# EAGLE schematic Arduino Environment Monitor (EAGLE 7.5.0)
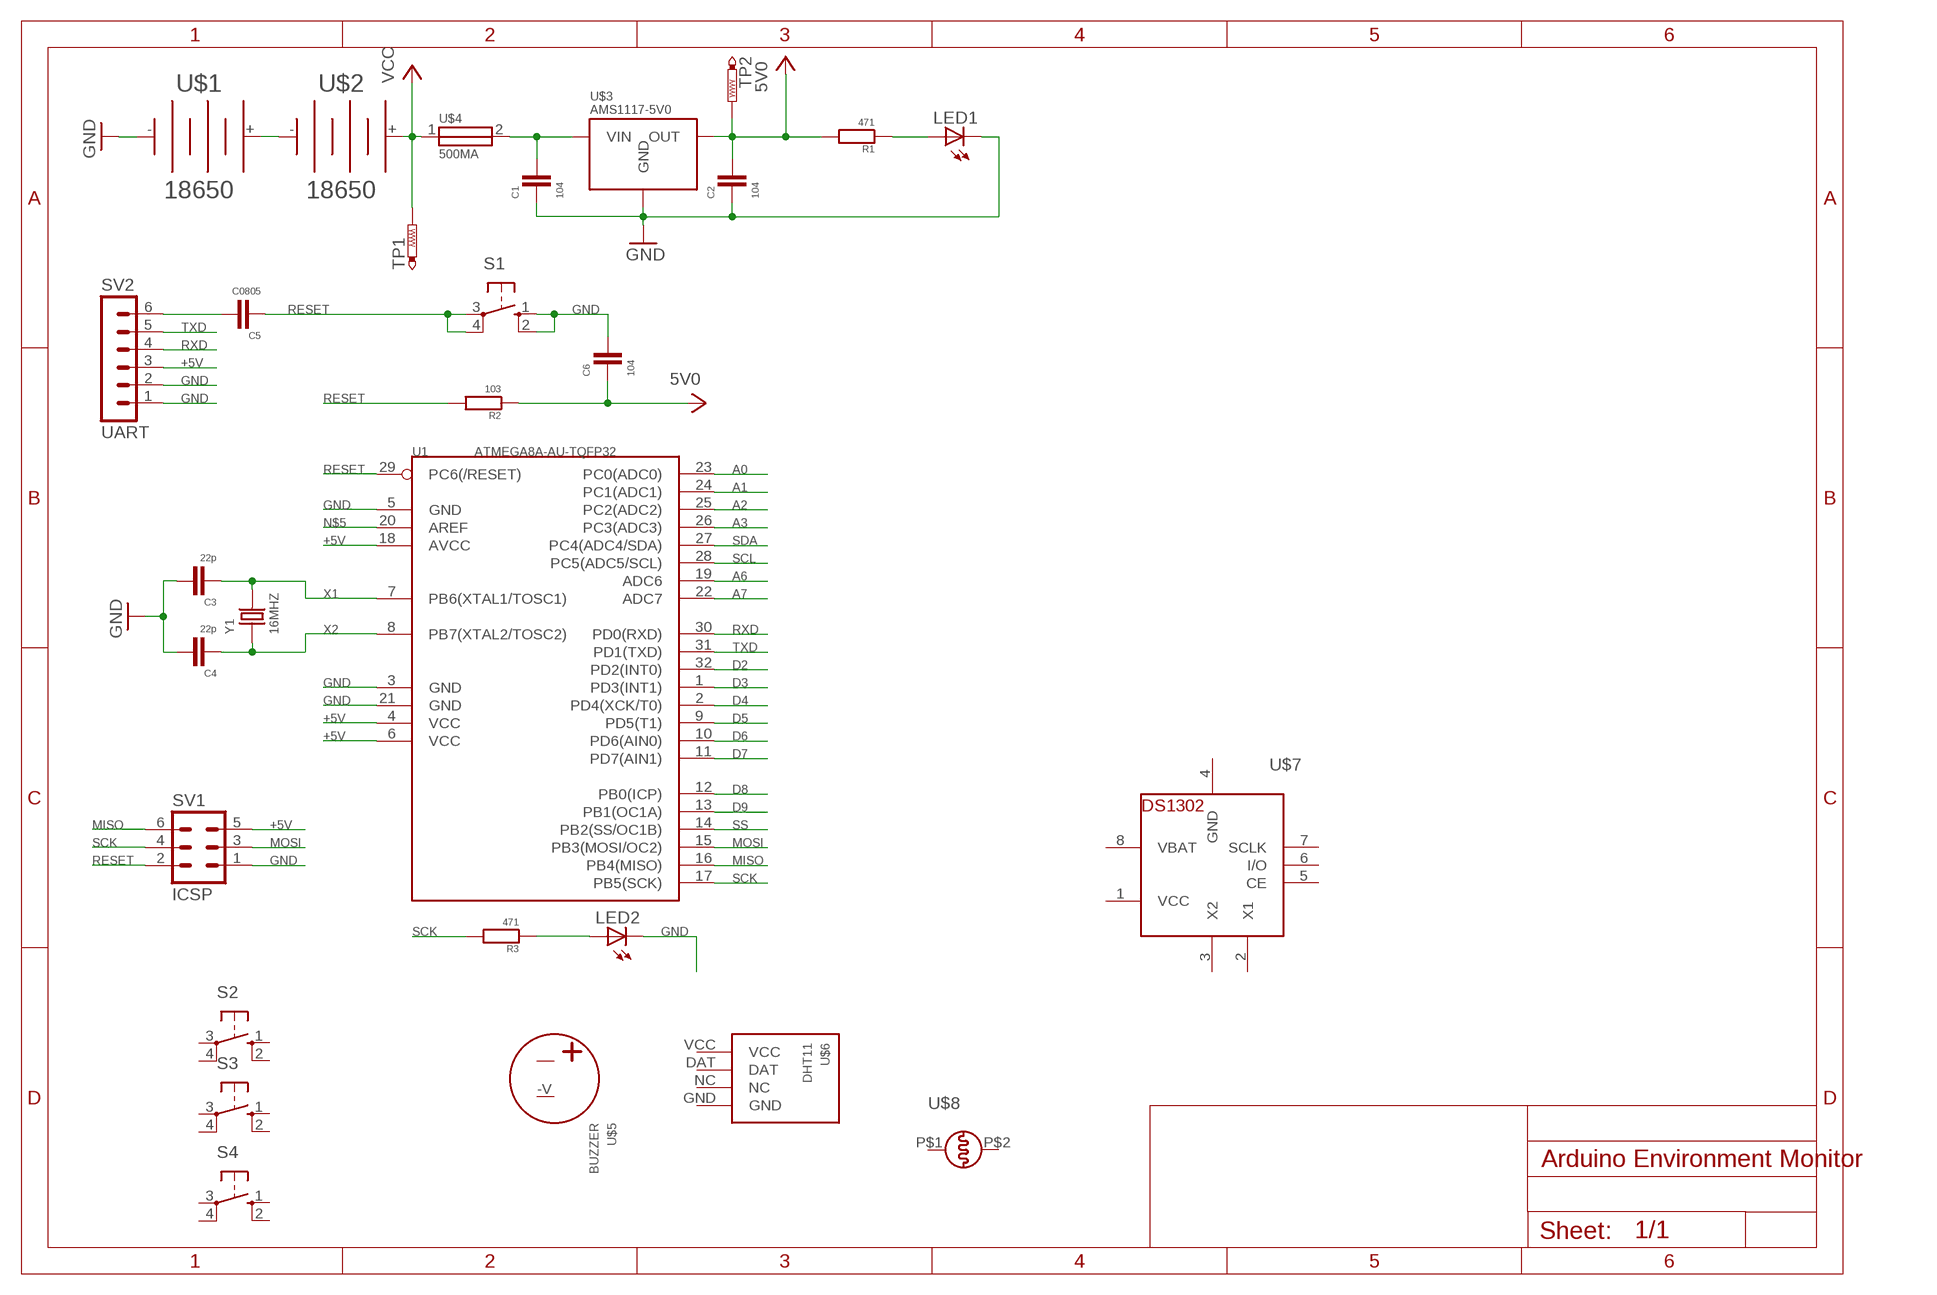
[diagram p0: schematic, sheet 1]

## Parts
C1  104  C0805  [C0805]
C2  104  C0805  [C0805]
C3  22p  CDIP  [CDIP]
C4  22p  CDIP  [CDIP]
C5  C0805  [C0805]
C6  104  C0805  [C0805]
LED1  LED3MM  [LED3MM]
LED2  LED3MM  [LED3MM]
R1  471  RDIP  [RDIP]
R2  103  RDIP  [RDIP]
R3  471  RDIP  [RDIP]
S1  10-XX  [B3F-10XX]
S2  40-XX  [B3F-40XX]
S3  40-XX  [B3F-40XX]
S4  40-XX  [B3F-40XX]
SV1  ICSP  MA03-2  [MA03-2]
SV2  UART  MA06-1  [MA06-1]
TP1  TEST-PADB1,27  [B1,27]
TP2  TEST-PADB1,27  [B1,27]
U1  ATMEGA8A-AU-TQFP32  MCU-ATMEGA8A-AU(TQFP32)  [TQFP32-0.8-7X7MM]
U$1  18650  18650SMD  [18650-SMD]
U$2  18650  18650SMD  [18650-SMD]
U$3  AMS1117-5V0  AMS1117-5V0SOT22  [SOT223]
U$4  500MA  FUSE0805  [F0805]
U$5  BUZZER  [BUZZER]
U$6  DHT11  [DHT11]
U$7  DS1302  [DIL08-ROUND]
U$8  LDR  [LDR]
Y1  16MHZ  DIP-CRYSTAL-16MHZ-18PF-30PPM-50R(HC49US)  [HC49US]

## Nets
+5V: C2.1 C6.2 R1.P$2 R2.P$1 SV1.5 SV2.3 TP2.TP U1.4(VCC) U1.6(VCC) U1.18(AVCC) U$3.OUT ; supply symbol labelled 5V0
A0: U1.23(PC0(ADC0))
A1: U1.24(PC1(ADC1))
A2: U1.25(PC2(ADC2))
A3: U1.26(PC3(ADC3))
A6: U1.19(ADC6)
A7: U1.22(ADC7)
D2: U1.32(PD2(INT0))
D3: U1.1(PD3(INT1))
D4: U1.2(PD4(XCK/T0))
D5: U1.9(PD5(T1))
D6: U1.10(PD6(AIN0))
D7: U1.11(PD7(AIN1))
D8: U1.12(PB0(ICP))
D9: U1.13(PB1(OC1A))
GND: C1.2 C2.2 C3.P$1 C4.P$1 C6.1 LED1.K(C) LED2.K(C) S1.1(S) S1.2(S1) SV1.1 SV2.1 SV2.2 U1.3(GND) U1.5(GND) U1.21(GND) U$1.- U$3.GND
MISO: SV1.6 U1.16(PB4(MISO))
MOSI: SV1.3 U1.15(PB3(MOSI/OC2))
N$1: U$1.+ U$2.-
N$2: C1.1 U$3.VIN U$4.2
N$3: C5.1 SV2.6
N$4: LED1.A R1.P$1
N$5: U1.20(AREF)
N$6: LED2.A R3.P$1
RESET: C5.2 R2.P$2 S1.3(P) S1.4(P1) SV1.2 U1.29(PC6(/RESET))
RXD: SV2.4 U1.30(PD0(RXD))
SCK: R3.P$2 SV1.4 U1.17(PB5(SCK))
SCL: U1.28(PC5(ADC5/SCL))
SDA: U1.27(PC4(ADC4/SDA))
SS: U1.14(PB2(SS/OC1B))
TXD: SV2.5 U1.31(PD1(TXD))
VCC: TP1.TP U$2.+ U$4.1
X1: C3.P$2 U1.7(PB6(XTAL1/TOSC1)) Y1.2
X2: C4.P$2 U1.8(PB7(XTAL2/TOSC2)) Y1.1
Unconnected: S2.1(S) S2.2(S1) S2.3(P) S2.4(P1) S3.1(S) S3.2(S1) S3.3(P) S3.4(P1) S4.1(S) S4.2(S1) S4.3(P) S4.4(P1) U$5.+V U$5.-V U$6.DAT U$6.GND U$6.NC U$6.VCC U$7.2(X1) U$7.3(X2) U$7.5(CE) U$7.6(I/O) U$7.7(SCLK) U$8.P$1 U$8.P$2

## Power pins joined to a net without a drawn wire
GND: U$7.4(GND)
VBAT: U$7.8(VBAT)
VCC: U$7.1(VCC)

## Library data of the parts
C1-C6 = RCLDA:C: CAPACITOR
LED1 LED2 = Display:LED: LED OSRAM: - CHIPLED LG R971, LG N971, LY N971, LG Q971, LY Q971, LO R971, LY R971 LH N974, LH R974 LS Q976, LO Q976, LY Q976 LO Q996 - Hyper CHIPLED LW Q18S LB Q993, LB Q99A, LB R99A - SideLED LS A670, LO A670, LY A670, LG A670, LP A670 LB A673, LV A673, LT A673, LW A673 LH A674 LY A675 LS A676, LA A676, LO A676, LY A676, LW A676 LS A679, LY A679, LG A679 - Hyper Micro SIDELED® LS Y876, LA Y876, LO Y876, LY Y876 LT Y87S - SmartLED LW L88C, LW L88S LB L89C, LB L89S, LG L890 LS L89K, LO L89K, LY L89K LS L896, LA L896, LO L896, LY L896 - TOPLED LS T670, LO T670, LY T670, LG T670, LP T670 LSG T670, LSP T670, LSY T670, LOP T670, LYG T670 LG T671, LOG T671, LSG T671 LB T673, LV T673, LT T673, LW T673 LH T674 LS T676, LA T676, LO T676, LY T676, LB T676, LH T676, LSB T676, LW T676 LB T67C, LV T67C, LT T67C, LS T67K, LO T67K, LY T67K, LW E67C LS E67B, LA E67B, LO E67B, LY E67B, LB E67C, LV E67C, LT E67C LW T67C LS T679, LY T679, LG T679 LS T770, LO T770, LY T770, LG T770, LP T770 LB T773, LV T773, LT T773, LW T773 LH T774 LS E675, LA E675, LY E675, LS T675 LS T776, LA T776, LO T776, LY T776, LB T776 LHGB T686 LT T68C, LB T68C - Hyper Mini TOPLED® LB M676 - Mini TOPLED Santana® LG M470 LS M47K, LO M47K, LY M47K Source: http://www.osram.convergy.de LUXEON: - LUMILED® LXK2-PW12-R00, LXK2-PW12-S00, LXK2-PW14-U00, LXK2-PW14-V00 LXK2-PM12-R00, LXK2-PM12-S00, LXK2-PM14-U00 LXK2-PE12-Q00, LXK2-PE12-R00, LXK2-PE12-S00, LXK2-PE14-T00, LXK2-PE14-U00 LXK2-PB12-K00, LXK2-PB12-L00, LXK2-PB12-M00, LXK2-PB14-N00, LXK2-PB14-P00, LXK2-PB14-Q00 LXK2-PR12-L00, LXK2-PR12-M00, LXK2-PR14-Q00, LXK2-PR14-R00 LXK2-PD12-Q00, LXK2-PD12-R00, LXK2-PD12-S00 LXK2-PH12-R00, LXK2-PH12-S00 LXK2-PL12-P00, LXK2-PL12-Q00, LXK2-PL12-R00 Source: www.luxeon.com KINGBRIGHT: KA-3528ASYC Source: www.kingbright.com
R1-R3 = RCLDA:R: RESISTOR
S1 = Button:10-XX: OMRON SWITCH; MPN: B3F-1000; OC_FARNELL: 176432; OC_NEWARK: 36M3542
S2-S4 = Button:40-XX: OMRON SWITCH; MF: OMRON COMPONENTS USA; MPN: B3F-4000; OC_FARNELL: 176434; OC_NEWARK: 36K3105
SV1 = Pin-Header:MA03-2: PIN HEADER; OC_FARNELL: unknown; OC_NEWARK: unknown
SV2 = Pin-Header:MA06-1: PIN HEADER; OC_FARNELL: unknown; OC_NEWARK: unknown
TP1 TP2 = TestPad:TEST-PAD: TEST PIN
U1 = Chip:MCU-ATMEGA8A-AU(TQFP32): 310010023; MPN: ATMEGA8A-AU
U$1 U$2 = Power:18650
U$3 = Chip:AMS1117-5V0
U$4 = RCLDA:FUSE
U$5 = Senser:BUZZER
U$6 = Senser:DHT11
U$7 = Chip:DS1302: DS1302 - Real time clock with supercap trickle charger
U$8 = Senser:LDR
Y1 = Crystal:DIP-CRYSTAL-16MHZ-18PF-30PPM-50R(HC49US): 306010037; MPN: 49S/18PF